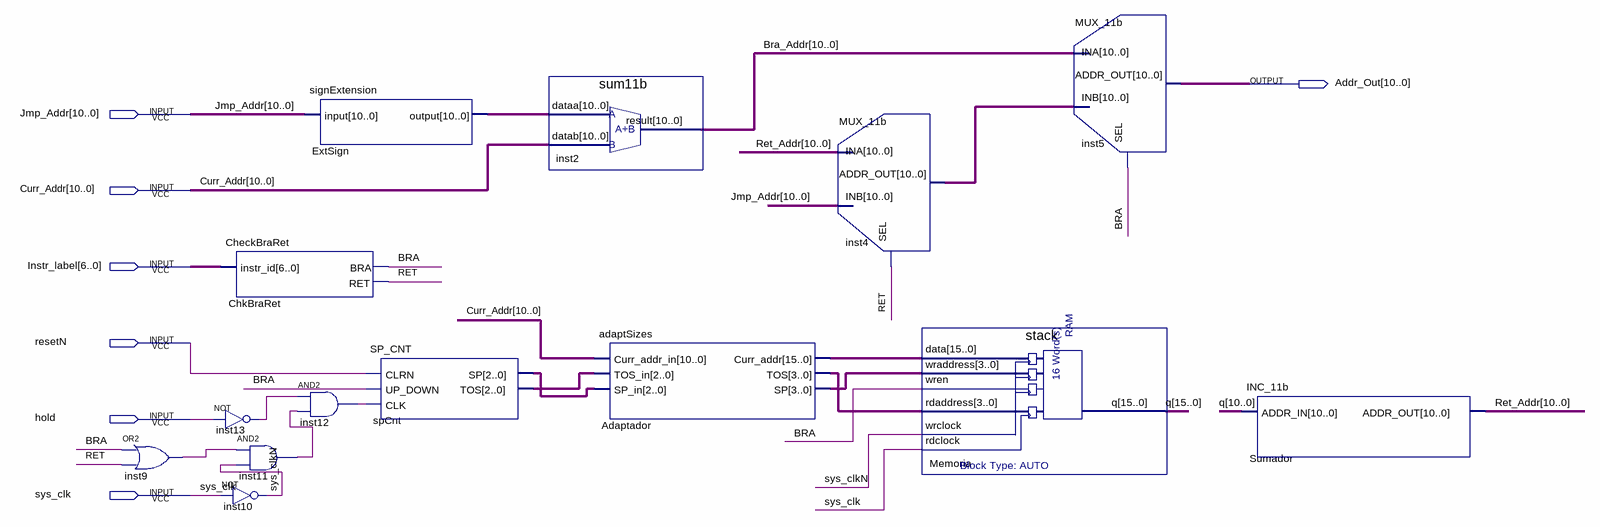
[diagram p0: schematic sheet]
// Quartus schematic BranchManager.bdf as structural Verilog: 14 symbols, 7 pins
module BranchManager (
  input  [10:0] Jmp_Addr,
  input  [10:0] Curr_Addr,
  input  [6:0] Instr_label,
  input  resetN,
  input  hold,
  input  sys_clk,
  output [10:0] Addr_Out
);

  wire BRA, inst9_out, inst11_out, inst12_out, inst13_out, RET, sys_clkN;
  wire [2:0] spCnt_sp, spCnt_tos;
  wire [3:0] Adaptador_sp, Adaptador_tos;
  wire [10:0] Bra_Addr, ExtSign_output, inst4_addr_out, Ret_Addr;
  wire [15:0] Adaptador_curr_addr, q;

  or inst9 (inst9_out, BRA, RET);
  CheckBraRet ChkBraRet (.instr_id(Instr_label), .BRA(BRA), .RET(RET));
  not inst13 (inst13_out, hold);
  and inst11 (inst11_out, inst9_out, sys_clkN);
  not inst10 (sys_clkN, sys_clk);
  signExtension ExtSign (.\input (Jmp_Addr), .\output (ExtSign_output));
  and inst12 (inst12_out, inst13_out, inst11_out);
  SP_CNT spCnt (.CLRN(resetN), .UP_DOWN(BRA), .CLK(inst12_out), .SP(spCnt_sp), .TOS(spCnt_tos));
  sum11b inst2 (.dataa(ExtSign_output), .datab(Curr_Addr), .result(Bra_Addr));
  adaptSizes Adaptador (
    .Curr_addr_in(Curr_Addr), .TOS_in(spCnt_tos), .SP_in(spCnt_sp), .Curr_addr(Adaptador_curr_addr),
    .TOS(Adaptador_tos), .SP(Adaptador_sp));
  MUX_11b inst4 (.INA(Ret_Addr), .SEL(RET), .INB(Jmp_Addr), .ADDR_OUT(inst4_addr_out));
  stack Memoria (
    .data(Adaptador_curr_addr), .wraddress(Adaptador_sp), .wren(BRA), .rdaddress(Adaptador_tos),
    .wrclock(sys_clkN), .rdclock(sys_clk), .q(q));
  MUX_11b inst5 (.INA(Bra_Addr), .SEL(BRA), .INB(inst4_addr_out), .ADDR_OUT(Addr_Out));
  INC_11b Sumador (.ADDR_IN(q[10:0]), .ADDR_OUT(Ret_Addr));
endmodule
